# Altium project science_board_proj_rev_1.PrjPcb
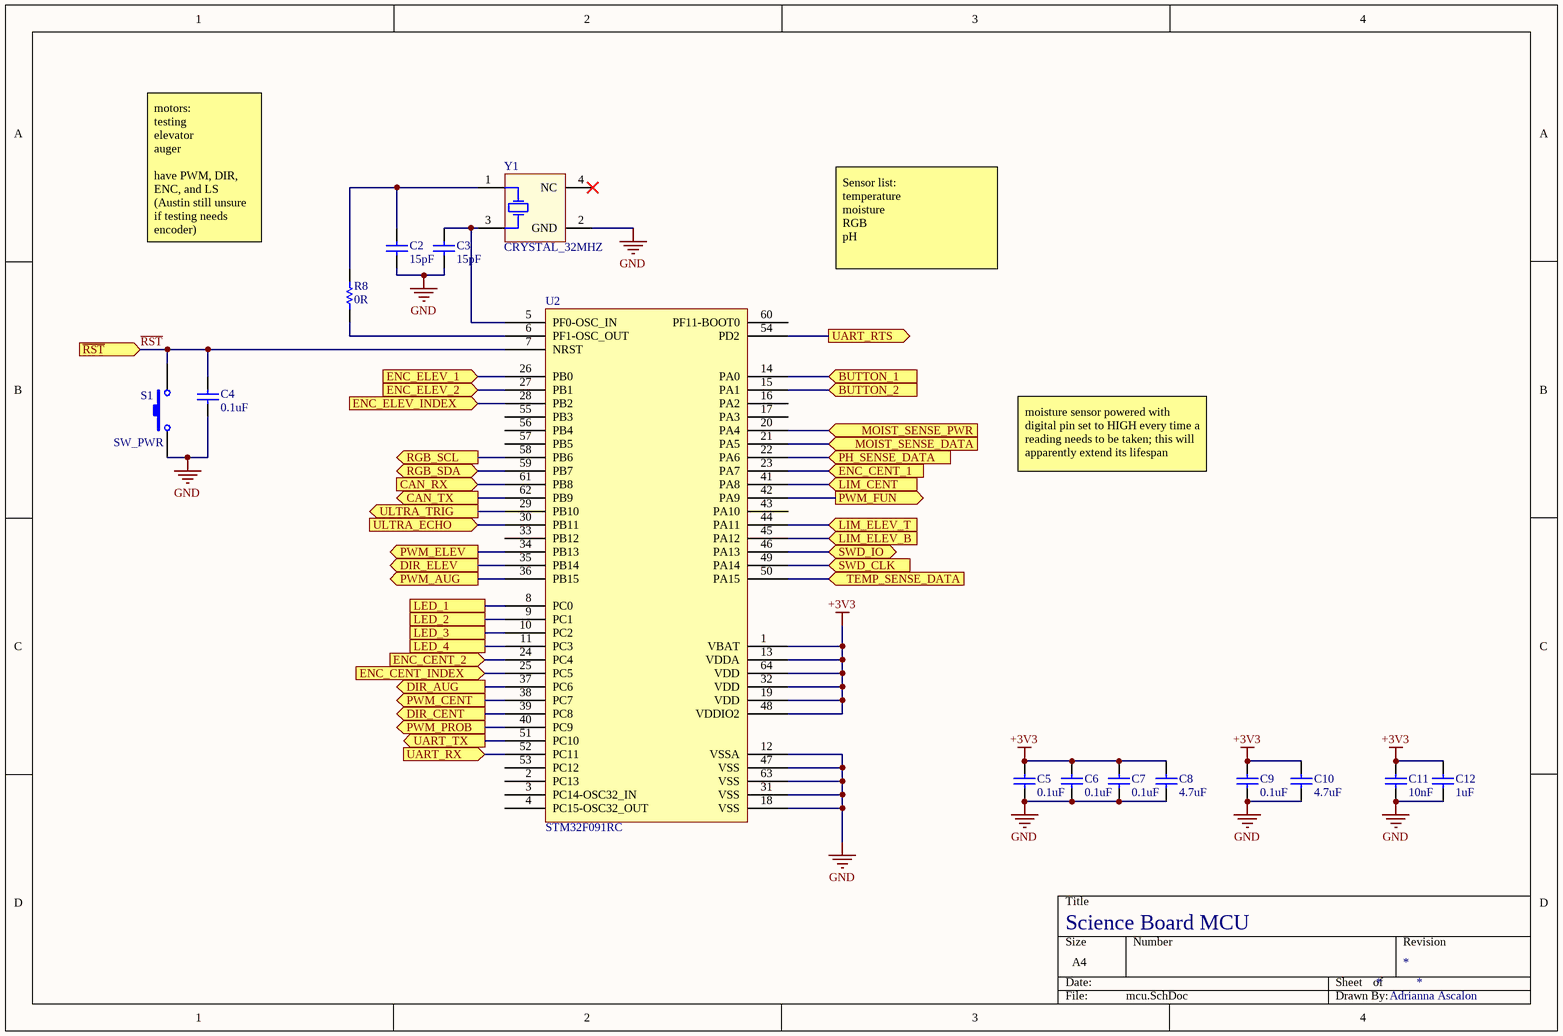
[diagram p0: mcu.SchDoc]
2 sheets, 39 parts. Net scope: flat (ports and power ports of the same name join across sheets).
Board file: science_board_pcb.PcbDoc
Sheets:
  mcu.SchDoc
  ph.SchDoc

## Sheet mcu.SchDoc: Science Board MCU
size A4; DrawnBy: Adrianna Ascalon

### Parts
C2  value 15pF  [CAPC0603(1608)55_N]  (hidden comment: CAP_15pF_0603)
C3  value 15pF  [CAPC0603(1608)55_N]  (hidden comment: CAP_15pF_0603)
C4  value 0.1uF  [CAPC0603(1608)55_N]  (hidden comment: CAP_0.1uF_16V_0603)
C5  value 0.1uF  [CAPC0603(1608)55_N]  (hidden comment: CAP_0.1uF_16V_0603)
C6  value 0.1uF  [CAPC0603(1608)55_N]  (hidden comment: CAP_0.1uF_16V_0603)
C7  value 0.1uF  [CAPC0603(1608)55_N]  (hidden comment: CAP_0.1uF_16V_0603)
C8  value 4.7uF  [CAPC0603(1608)55_N]  (hidden comment: CAP_4.7uF_0603)
C9  value 0.1uF  [CAPC0603(1608)55_N]  (hidden comment: CAP_0.1uF_16V_0603)
C10  value 4.7uF  [CAPC0603(1608)55_N]  (hidden comment: CAP_4.7uF_0603)
C11  value 10nF  [CAPC0603(1608)55_N]  (hidden comment: CAP_10nF_0603)
C12  value 1uF  [CAPC0603(1608)55_N]  (hidden comment: CAP_1uF_16V_0603)
R8  value 0R  [RESC0603(1608)_N]  (hidden comment: RES_0R_0603)
S1  SW_PWR  [PTS830GM140]
U2  STM32F091RC  [STM_LQFP64_N]
Y1  CRYSTAL_32MHZ  [AVX-CX2520DB32000D0GEJZ1-4_V]

### Ports
BUTTON_1 (in), BUTTON_2 (in), CAN_RX (in), CAN_TX (out), DIR_AUG (out), DIR_CENT (out), DIR_ELEV (out), ENC_CENT_1 (in), ENC_CENT_2 (in), ENC_CENT_INDEX (in), ENC_ELEV_1 (in), ENC_ELEV_2 (in), ENC_ELEV_INDEX (in), LED_1, LED_2, LED_3, LED_4, LIM_CENT (in), LIM_ELEV_B (in), LIM_ELEV_T (in), MOIST_SENSE_DATA (in), MOIST_SENSE_PWR (in), PH_SENSE_DATA (in), PWM_AUG (out), PWM_CENT (out), PWM_ELEV (out), PWM_FUN (out), PWM_PROB (out), RGB_SCL (out), RGB_SDA (bidir), SWD_CLK (in), SWD_IO (bidir), TEMP_SENSE_DATA (in), UART_RTS (out), UART_RX (in), UART_TX (out), ULTRA_ECHO (in), ULTRA_TRIG (out), ~{RST} (in)

### Nets
+3V3: C5.1 C6.1 C7.1 C8.2 C9.1 C10.2 C11.2 C12.2 U2.1(VBAT) U2.13(VDDA) U2.19(VDD) U2.32(VDD) U2.48(VDDIO2) U2.64(VDD)
GND: C2.1 C3.1 C4.1 C5.2 C6.2 C7.2 C8.1 C9.2 C10.1 C11.1 C12.1 S1.1 U2.12(VSSA) U2.18(VSS) U2.31(VSS) U2.47(VSS) U2.63(VSS) Y1.2(GND)
~{RST}: C4.2 S1.2 U2.7(NRST) ; port ~{RST}
NetC2_2: C2.2 R8.2 Y1.1(HOT)
NetC3_2: C3.2 U2.5(PF0-OSC_IN) Y1.3(HOT)
NetR8_1: R8.1 U2.6(PF1-OSC_OUT)
NetR10_2: U2.22(PA6) ; port PH_SENSE_DATA
NetU2_8: U2.8(PC0) ; port LED_1
NetU2_9: U2.9(PC1) ; port LED_2
NetU2_10: U2.10(PC2) ; port LED_3
NetU2_11: U2.11(PC3) ; port LED_4
NetU2_14: U2.14(PA0) ; port BUTTON_1
NetU2_15: U2.15(PA1) ; port BUTTON_2
NetU2_20: U2.20(PA4) ; port MOIST_SENSE_PWR
NetU2_21: U2.21(PA5) ; port MOIST_SENSE_DATA
NetU2_23: U2.23(PA7) ; port ENC_CENT_1
NetU2_24: U2.24(PC4) ; port ENC_CENT_2
NetU2_25: U2.25(PC5) ; port ENC_CENT_INDEX
NetU2_26: U2.26(PB0) ; port ENC_ELEV_1
NetU2_27: U2.27(PB1) ; port ENC_ELEV_2
NetU2_28: U2.28(PB2) ; port ENC_ELEV_INDEX
NetU2_29: U2.29(PB10) ; port ULTRA_TRIG
NetU2_30: U2.30(PB11) ; port ULTRA_ECHO
NetU2_34: U2.34(PB13) ; port PWM_ELEV
NetU2_35: U2.35(PB14) ; port DIR_ELEV
NetU2_36: U2.36(PB15) ; port PWM_AUG
NetU2_37: U2.37(PC6) ; port DIR_AUG
NetU2_38: U2.38(PC7) ; port PWM_CENT
NetU2_39: U2.39(PC8) ; port DIR_CENT
NetU2_40: U2.40(PC9) ; port PWM_PROB
NetU2_41: U2.41(PA8) ; port LIM_CENT
NetU2_42: U2.42(PA9) ; port PWM_FUN
NetU2_44: U2.44(PA11) ; port LIM_ELEV_T
NetU2_45: U2.45(PA12) ; port LIM_ELEV_B
NetU2_46: U2.46(PA13) ; port SWD_IO
NetU2_49: U2.49(PA14) ; port SWD_CLK
NetU2_50: U2.50(PA15) ; port TEMP_SENSE_DATA
NetU2_51: U2.51(PC10) ; port UART_TX
NetU2_52: U2.52(PC11) ; port UART_RX
NetU2_54: U2.54(PD2) ; port UART_RTS
NetU2_58: U2.58(PB6) ; port RGB_SCL
NetU2_59: U2.59(PB7) ; port RGB_SDA
NetU2_61: U2.61(PB8) ; port CAN_RX
NetU2_62: U2.62(PB9) ; port CAN_TX

Not connected (* = marked no-connect by the designer): U2 2(PC13) 3(PC14-OSC32_IN) 4(PC15-OSC32_OUT) 16(PA2) 17(PA3) 33(PB12) 43(PA10) 53(PC12) 55(PB3) 56(PB4) 57(PB5) 60(PF11-BOOT0); Y1 4(NC)*

### Notes on the sheet
- motors:
  testing
  elevator
  auger
  have PWM, DIR, ENC, and LS
  (Austin still unsure if testing needs encoder)
  Auger doesn't need ENC or LS
- Sensor list:
  temperature
  moisture
  RGB
  pH
- moisture sensor powered with digital pin set to HIGH every time a reading needs to be taken; this will apparently extend its lifespan

### Library data of the parts
C2 C3 = CAP_15pF_0603: CAP CER 15PF 250V NPO 0603; Manufacturer: Yageo; MPN: AC0603JRNPOYBN150; Temperature Coefficient: NP0; Dimensions: 0.063" L x 0.031" W (1.60mm x 0.80mm); Package: 0603 (1608 Metric); Voltage Rating: 250v; Digikey Part Number: 311-3282-1-ND
C4-C7 C9 = CAP_0.1uF_16V_0603: CAP CER 0.1UF 16V X7R 0603; Manufacturer: Yageo; MPN: CC0603KRX7R7BB104; Dimensions: 0.063" L x 0.031" W (1.60mm x 0.80mm); Package: 0603 (1608 Metric); Temperature Coefficient: X7R; Voltage Rating: 16V; Digikey Part Number: 311-1088-1-ND
C8 C10 = CAP_4.7uF_0603: CAP CER 4.7UF 6.3V X5R 0603; Manufacturer: Yageo; MPN: CC0603KRX5R5BB475; Dimensions: 0.063" L x 0.031" W (1.60mm x 0.80mm); Package: 0603 (1608 Metric); Temperature Coefficient: X5R; Voltage Rating: 6.3V; Digikey Part Number: 311-1521-1-ND
C11 = CAP_10nF_0603: CAP CER 10000PF 16V X7R 0603; Manufacturer: Yageo; MPN: CC0603KRX7R7BB103; Dimensions: 0.063" L x 0.031" W (1.60mm x 0.80mm); Package: 0603 (1608 Metric); Temperature Coefficient: X7R; Voltage Rating: 16V; Digikey Part Number: 311-3369-1-ND
C12 = CAP_1uF_16V_0603: CAP CER 1UF 16V Y5V 0603; Manufacturer: Yageo; MPN: CC0603ZRY5V7BB105; Dimensions: 0.063" L x 0.031" W (1.60mm x 0.80mm); Package: 0603 (1608 Metric); Temperature Coefficient: Y5V; Voltage Rating: 16V; Digikey Part Number: 311-1372-1-ND
R8 = RES_0R_0603: RES SMD 0 OHM JUMPER 1/10W 0603; Manufacturer: Yageo; MPN: RC0603JR-070RL; Package: 0603 (1608 Metric); Dimensions: 0.063" L x 0.031" W (1.60mm x 0.80mm); Digikey Part Number: 311-0.0GRCT-ND
S1 = SW_PWR: Power Switch (Red); pin to pad: 2>4; MPN: PTS830GM140 SMTR LFS; Manufacturer: C&K; ComponentLink1Description: Datasheet; ComponentLink1URL: https://www.ckswitches.com/media/1478/pts830.pdf; Digikey Part Number: CKN10587CT-ND
U2 = STM32F091RC: Manufacturer: STMicroelectronics; Package: 64-LQFP; ComponentLink1Description: Datasheet; ComponentLink1URL: https://www.st.com/content/ccc/resource/technical/document/datasheet/95/3c/2e/5b/21/09/45/a6/DM00115237.pdf/files/DM00115237.pdf/jcr:content/translations/en.DM00115237.pdf#%5B%7B%22num%22%3A96%2C%22gen%22%3A0%7D%2C%7B%22name%22%3A%22XYZ%22%7D%2C67%2C755%2Cnull%5D; MPN: STM32F091RC; Digikey Part Number: 497-15167-ND
Y1 = CRYSTAL_32MHZ: CRYSTAL 32MHZ 8PF SMD; Manufacturer: Kyocera International Inc. Electronic Components; MPN: CX2520DB32000D0GPSC1; Package: 4-SMD, No Lead; Dimensions: 0.098" L x 0.079" W (2.50mm x 2.00mm); Digikey Part Number: 1253-1730-1-ND

## Sheet ph.SchDoc: Science Board pH Sensing
size A4
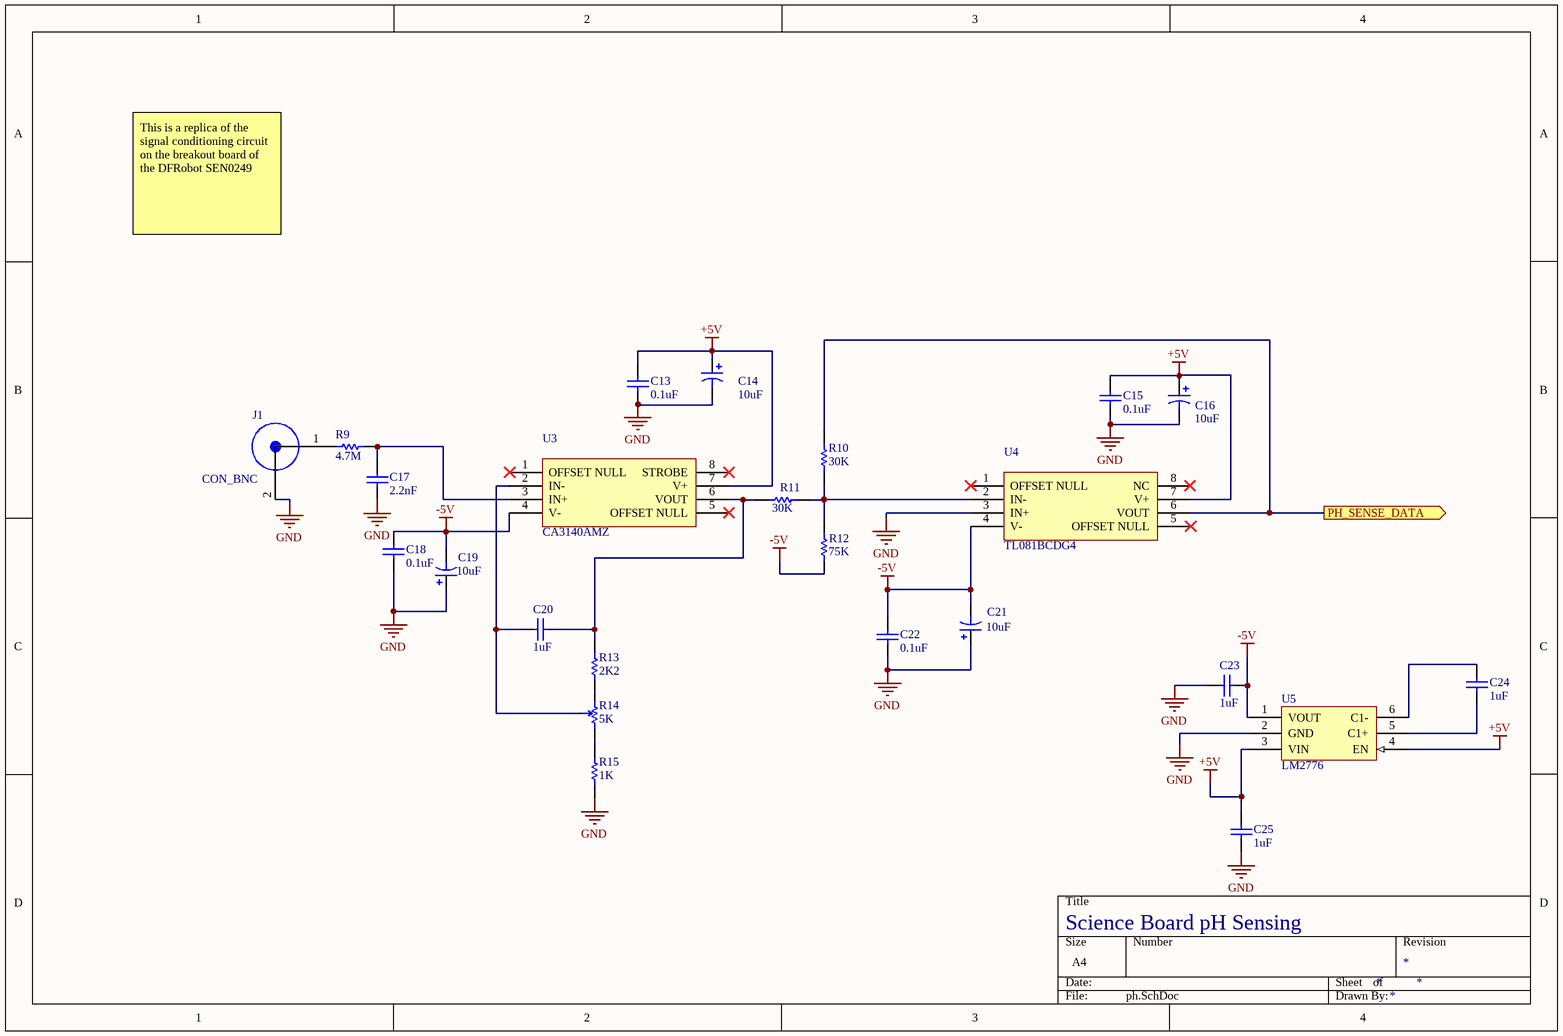
[diagram p1: ph.SchDoc]

### Parts
C13  value 0.1uF  [CAPC0603(1608)55_N]  (hidden comment: CAP_0.1uF_50V_0603)
C14  value 10uF  [AVX-CAPC3528_V]  (hidden comment: CAP_10uF_0603_POL)
C15  value 0.1uF  [CAPC0603(1608)55_N]  (hidden comment: CAP_0.1uF_50V_0603)
C16  value 10uF  [AVX-CAPC3528_V]  (hidden comment: CAP_10uF_0603_POL)
C17  value 2.2nF  [CAPC0603(1608)55_N]  (hidden comment: CAP_2.2nF_0603)
C18  value 0.1uF  [CAPC0603(1608)55_N]  (hidden comment: CAP_0.1uF_50V_0603)
C19  value 10uF  [AVX-CAPC3528_V]  (hidden comment: CAP_10uF_0603_POL)
C20  value 1uF  [CAPC0603(1608)55_N]  (hidden comment: CAP_1uF_16V_0603)
C21  value 10uF  [AVX-CAPC3528_V]  (hidden comment: CAP_10uF_0603_POL)
C22  value 0.1uF  [CAPC0603(1608)55_N]  (hidden comment: CAP_0.1uF_50V_0603)
C23  value 1uF  [CAPC0603(1608)55_N]  (hidden comment: CAP_1uF_16V_0603)
C24  value 1uF  [CAPC0603(1608)55_N]  (hidden comment: CAP_1uF_16V_0603)
C25  value 1uF  [CAPC0603(1608)55_N]  (hidden comment: CAP_1uF_16V_0603)
J1  CON_BNC  [1-1337543-0]
R9  value 4.7M  [RESC0603(1608)_N]  (hidden comment: RES_4M7_0603)
R10  value 30K  [RESC0603(1608)_N]  (hidden comment: RES_30K_0603)
R11  value 30K  [RESC0603(1608)_N]  (hidden comment: RES_30K_0603)
R12  value 75K  [RESC0603(1608)_N]  (hidden comment: RES_75K_0603)
R13  value 2K2  [RESC0603(1608)_N]  (hidden comment: RES_2K2_0603)
R14  value 5K  [3362P-1-502LF]  (hidden comment: POT_5K)
R15  value 1K  [RESC0603(1608)_N]  (hidden comment: RES_1K_0603)
U3  CA3140AMZ  [CA3140AMZ]
U4  TL081BCDG4  [TL081BCDG4]
U5  LM2776  [SOT23-6]

### Ports
PH_SENSE_DATA (out)

### Nets
+5V: C13.2 C14.1 C15.2 C16.1 C25.2 U3.7(V+) U4.7(V+) U5.3(VIN) U5.4(EN)
-5V: C18.2 C19.2 C21.2 C22.2 C23.1 R12.1 U3.4(V-) U4.4(V-) U5.1(VOUT)
GND: C13.1 C14.2 C15.1 C16.2 C17.1 C18.1 C19.1 C21.1 C22.1 C23.2 C25.1 J1.2 R15.1 U4.3(IN+) U5.2(GND)
NetC17_2: C17.2 R9.2 U3.3(IN+)
NetC20_1: C20.1 R14.3 U3.2(IN-)
NetC20_2: C20.2 R11.1 R13.2 U3.6(VOUT)
NetC24_1: C24.1 U5.5(C1+)
NetC24_2: C24.2 U5.6(C1-)
NetJ1_1: J1.1 R9.1
NetR10_1: R10.1 R11.2 R12.2 U4.2(IN-)
NetR10_2: R10.2 U4.6(VOUT) ; port PH_SENSE_DATA
NetR13_1: R13.1 R14.1
NetR14_2: R14.2 R15.2

Not connected (* = marked no-connect by the designer): U3 1(OFFSET_NULL)* 5(OFFSET_NULL)* 8(STROBE)*; U4 1(OFFSET_NULL)* 5(OFFSET_NULL)* 8(NC)*

### Notes on the sheet
- This is a replica of the signal conditioning circuit on the breakout board of the DFRobot SEN0249

### Library data of the parts
C13 C15 C18 C22 = CAP_0.1uF_50V_0603: CAP CER 0.1UF 50V X7R 0603; Manufacturer: Yageo; MPN: CC0603KRX7R9BB104; Dimensions: 0.063" L x 0.031" W (1.60mm x 0.80mm); Package: 0603 (1608 Metric); Temperature Coefficient: X7R; Voltage Rating: 50V; Digikey Part Number: 311-1344-1-ND
C14 C16 C19 C21 = CAP_10uF_0603_POL: Capacitor, Tantalum, 10uF 10% 20V MCCT-B (3528); Part Number: CC0603MRX5R6BB106; Manufacturer: Yageo; Temperature Coefficient: X5R; Voltage Rating: 10V; Dimensions: 0.063" L x 0.031" W (1.60mm x 0.80mm); Package: 0603 (1608 Metric)
C17 = CAP_2.2nF_0603: CAP CER 2.2NF 25V X7R 0603; Manufacturer: Yageo; MPN: CC0603KRX7R8BB222; Dimensions: 0.063" L x 0.031" W (1.60mm x 0.80mm); Package: 0603 (1608 Metric); Temperature Coefficient: X7R; Voltage Rating: 25V; Digikey Part Number: 311-3653-1-ND
C20 C23-C25 = CAP_1uF_16V_0603: as C12 on sheet mcu; Dimensions: 0.063" L x 0.031" W (1.60mm x 0.80mm); Package: 0603 (1608 Metric); Temperature Coefficient: Y5V; Voltage Rating: 16V; Digikey Part Number: 311-1372-1-ND
J1 = CON_BNC: Manufacturer: TE Connectivity; MPN: 1-1337543-0; Digikey Part Number: A97553-ND
R9 = RES_4M7_0603: RES SMD 4.7M OHM 1% 1/10W 0603; Manufacturer: Yageo; MPN: RC0603FR-074M7L; Package: 0603 (1608 Metric); Dimensions: 0.063" L x 0.031" W (1.60mm x 0.80mm); Tolerance: 1%; Digikey Part Number: 311-4.70MHRCT-ND
R10 R11 = RES_30K_0603: RES SMD 30K OHM 0.5% 1/10W 0603; Manufacturer: Yageo; MPN: RT0603DRD0730KL; Package: 0603 (1608 Metric); Dimensions: 0.063" L x 0.031" W (1.60mm x 0.80mm); Tolerance: 0.5%; Digikey Part Number: 311-30KDCT-ND
R12 = RES_75K_0603: RES SMD 75K OHM 0.5% 1/10W 0603; Manufacturer: Yageo; MPN: RT0603DRD0775KL; Package: 0603 (1608 Metric); Dimensions: 0.063" L x 0.031" W (1.60mm x 0.80mm); Tolerance: 0.5%; Digikey Part Number: 311-75KDCT-ND
R13 = RES_2K2_0603: RES SMD 2.2K OHM 1% 1/10W 0603; Manufacturer: Yageo; MPN: RC0603FR-072K2L; Dimensions: 0.063" L x 0.031" W (1.60mm x 0.80mm); Package: 0603 (1608 Metric); Tolerance: 1%; Digikey Part Number: 311-2.20KHRCT-ND
R14 = POT_5K: TRIMMER 5K OHM 0.5W PC PIN TOP; Manufacturer: Bourns Inc.; Tolerance: 10%; Dimensions: 0.275" x 0.260" Face x 0.185" H (6.99mm x 6.60mm x 4.70mm); MPN: 3362P-1-502LF; Digikey Part Number: 3362P-502LF-ND
R15 = RES_1K_0603: RES SMD 1K OHM 5% 1/10W 0603; Manufacturer: Yageo; MPN: RC0603JR-071KL; Dimensions: 0.063" L x 0.031" W (1.60mm x 0.80mm); Tolerance: 5%; Package: 0603 (1608 Metric); Digikey Part Number: 311-1.0KGRCT-ND
U3 = CA3140AMZ: 4.5MHz, BiMOS Operational Amplifier with MOSFET Input/Bipolar Output; Manufacturer: Renesas Electronics America Inc.; Digikey Part Number: CA3140AMZ-ND; MPN: CA3140AMZ
U4 = TL081BCDG4: IC OPAMP JFET 3MHZ 8SOIC; Manufacturer: Texas Instruments; MPN: TL081BCD; Digikey Part Number: 296-34259-5-ND
U5 = LM2776: LM2776 Switched Capacitor Inverter; MPN: LM2776DBVR; Manufacturer: Texas Instruments; Digikey Part Number: 296-43957-1-ND

## Nets that join several sheets
GND: mcu (18 pins), ph (15 pins)
NetR10_2: mcu (U2.22), ph (R10.2 U4.6)